# Altium schematic sheet isolation.SchDoc
size A4; SheetNumber: 2; SheetTotal: 6
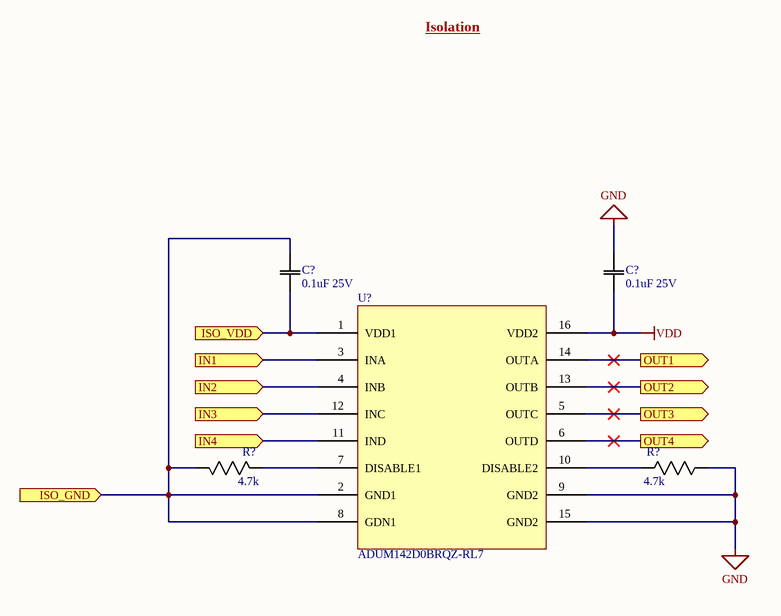
[diagram p0: isolation.SchDoc]

## Parts
(Parts that share a designator on the sheet are numbered #1, #2 ... from top to bottom, then left to right.)
C?#1  0.1uF 25V  [0805]
C?#2  0.1uF 25V  [0805]
R?#1  4.7k  [0603]
R?#2  4.7k  [0603]
U?  ADUM142D0BRQZ-RL7  [SOP64P600X175-16N]

## Ports
IN1 (in), IN2 (in), IN3 (in), IN4 (in), ISO_GND (in), ISO_VDD (in), OUT1 (out), OUT2 (out), OUT3 (out), OUT4 (out)

## Nets
GND: C?#2.2(C2) R?#2.1(R1) U?.9(GND2) U?.15(GND2)
VDD: C?#2.1(C1) U?.16(VDD2)
IN1: U?.3(INA) ; port IN1
IN2: U?.4(INB) ; port IN2
IN3: U?.12(INC) ; port IN3
IN4: U?.11(IND) ; port IN4
ISO_GND: C?#1.2(C2) R?#1.1(R1) U?.2(GND1) U?.8(GDN1) ; port ISO_GND
ISO_VDD: C?#1.1(C1) U?.1(VDD1) ; port ISO_VDD
OUT1: U?.14(OUTA) ; port OUT1
OUT2: U?.13(OUTB) ; port OUT2
OUT3: U?.5(OUTC) ; port OUT3
OUT4: U?.6(OUTD) ; port OUT4
NetR?#1_2: R?#1.2(R2) U?.7(DISABLE1)
NetR?#2_2: R?#2.2(R2) U?.10(DISABLE2)

## Notes on the sheet
- Isolation

## Library data of the parts
C?#1 C?#2 = CAP 0.1uF 25V: Default Symbol for Capacitors; Temperature Coefficient: X7R; Tolerance: 10%; Value: 0.1uF; Rating: 25V; Operating Temperature: -55°C ~ 125°C; Part Number: CAP 0.1uF 25V
R?#1 R?#2 = RES 4.7k 1/8W - 5%: Default Resistor Symbol; Value: 1; Power (Watts): 0.125W; Tolerance: 5%; Package: 0805; Part Number: RES 4.7k 1/8W - 5%
U? = ADUM142D0BRQZ-RL7: DGTL ISO 3000VRMS 4CH GP 16QSOP; Part Number: ADUM142D0BRQZ-RL7; Supplier 1: Digi-Key; Supplier Part Number 1: 505-ADUM142D0BRQZ-RL7CT-ND; Suppler URL 1: https://www.digikey.ca/en/products/detail/analog-devices-inc/ADUM142D0BRQZ-RL7/7388629